# Altium schematic sheet FLASH_EMMC.SchDoc
size 420 x 297 mm; SheetNumber: 17; SheetTotal: 23
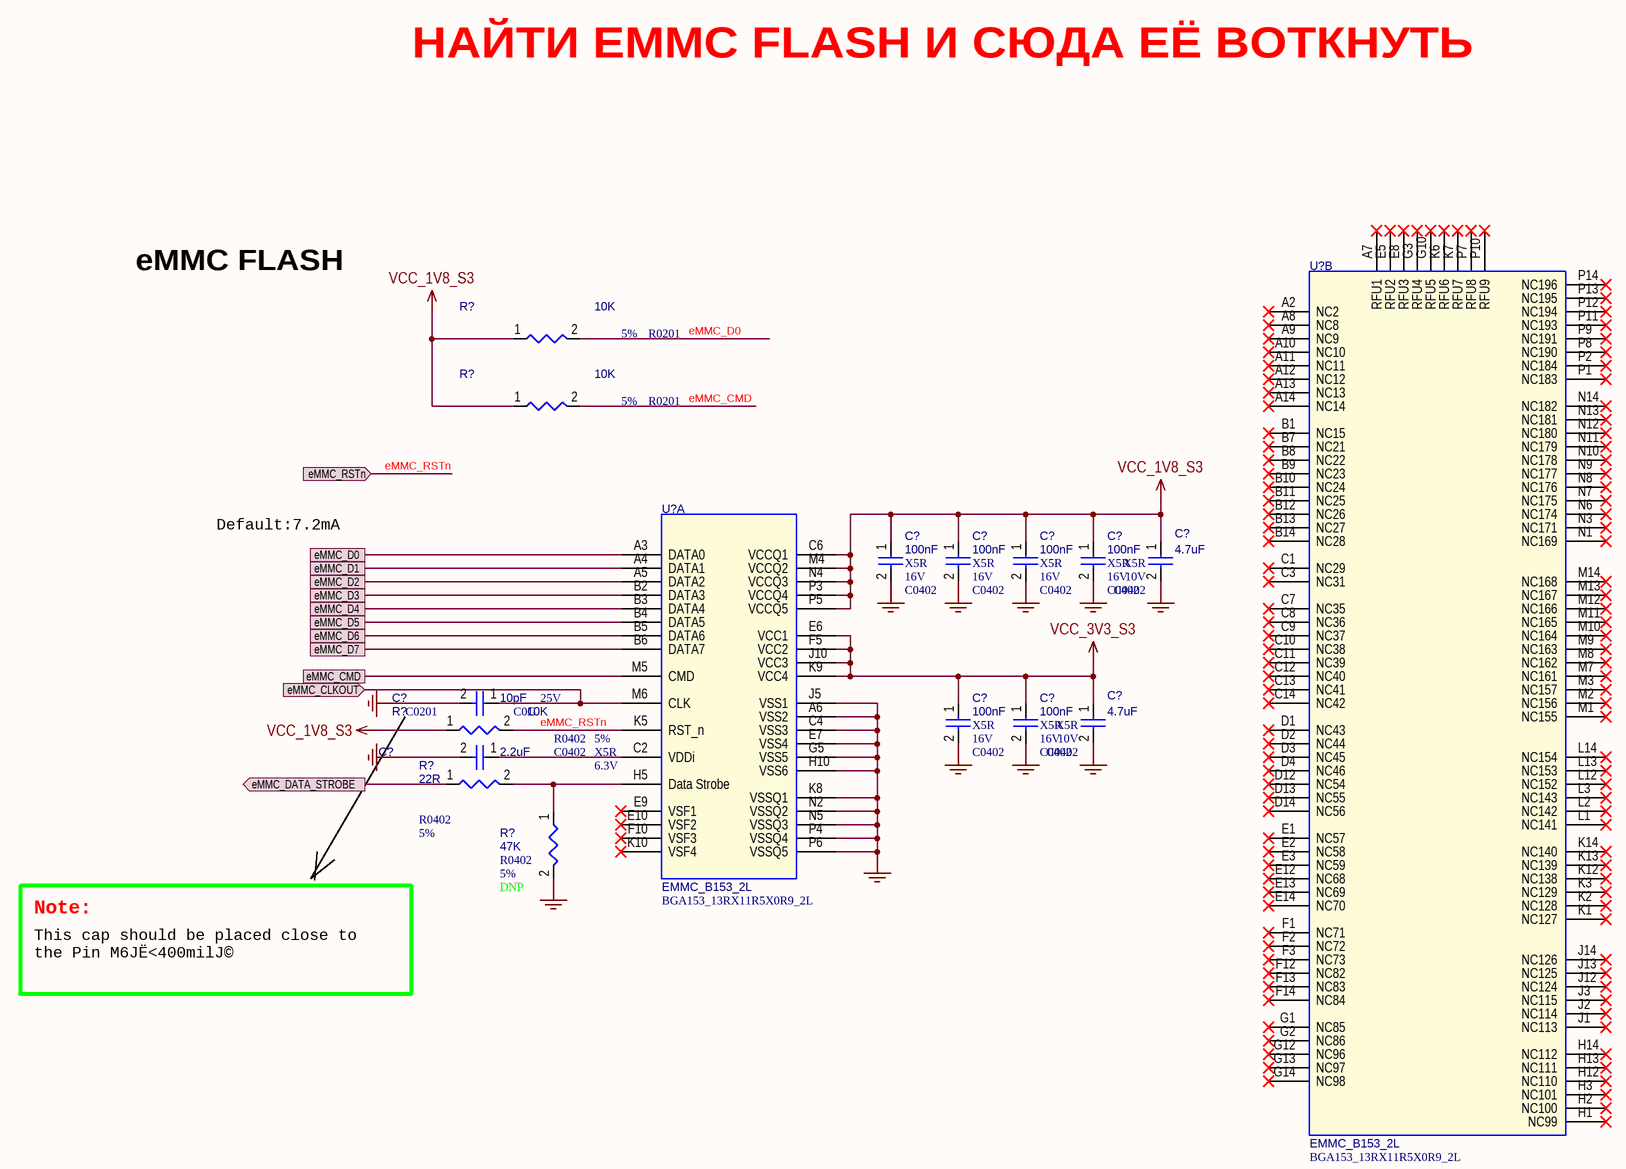
[diagram p0: FLASH_EMMC.SchDoc]

## Parts
(Parts that share a designator on the sheet are numbered #1, #2 ... from top to bottom, then left to right.)
C?#1  100nF  Dielectric: X5R  Voltage: 16V  [C0402]
C?#2  100nF  Dielectric: X5R  Voltage: 16V  [C0402]
C?#3  100nF  Dielectric: X5R  Voltage: 16V  [C0402]
C?#4  100nF  Dielectric: X5R  Voltage: 16V  [C0402]
C?#5  4.7uF  Dielectric: X5R  Voltage: 10V  [C0402]
C?#6  10pF  Dielectric: C0G  Voltage: 25V  [C0201]
C?#7  100nF  Dielectric: X5R  Voltage: 16V  [C0402]
C?#8  100nF  Dielectric: X5R  Voltage: 16V  [C0402]
C?#9  4.7uF  Dielectric: X5R  Voltage: 10V  [C0402]
C?#10  2.2uF  Dielectric: X5R  Voltage: 6.3V  [C0402]
R?#1  10K  Tolerance: 5%  PCB Footprint: R0201  [R0402]
R?#2  10K  Tolerance: 5%  PCB Footprint: R0201  [R0402]
R?#3  10K  Tolerance: 5%  [R0402]
R?#4  22R  Tolerance: 5%  [R0402]
R?#5  47K  Tolerance: 5%  option: DNP  [R0402]
U?#1  EMMC_B153_2L  [BGA153_13RX11R5X0R9_2L]  (part B of 2)
U?#2  EMMC_B153_2L  [BGA153_13RX11R5X0R9_2L]  (part A of 2)

## Ports
eMMC_CLKOUT (in, see RK3588_FLASH_SD_EMMC[3B]), eMMC_CMD (see RK3588_FLASH_SD_EMMC[3B]), eMMC_D0 (see RK3588_FLASH_SD_EMMC[3B]), eMMC_D1 (see RK3588_FLASH_SD_EMMC[3B]), eMMC_D2 (see RK3588_FLASH_SD_EMMC[3B]), eMMC_D3 (see RK3588_FLASH_SD_EMMC[3B]), eMMC_D4 (see RK3588_FLASH_SD_EMMC[3B]), eMMC_D5 (see RK3588_FLASH_SD_EMMC[3B]), eMMC_D6 (see RK3588_FLASH_SD_EMMC[3B]), eMMC_D7 (see RK3588_FLASH_SD_EMMC[3B]), eMMC_DATA_STROBE (out, see RK3588_FLASH_SD_EMMC[3B]), eMMC_RSTn (in, see RK3588_FLASH_SD_EMMC[3B])

## Nets
GND: C?#1.2 C?#2.2 C?#3.2 C?#4.2 C?#5.2 C?#6.2 C?#7.2 C?#8.2 C?#9.2 C?#10.2 R?#5.2 U?#2.A6(VSS2) U?#2.C4(VSS3) U?#2.E7(VSS4) U?#2.G5(VSS5) U?#2.H10(VSS6) U?#2.J5(VSS1) U?#2.K8(VSSQ1) U?#2.N2(VSSQ2) U?#2.N5(VSSQ3) U?#2.P4(VSSQ4) U?#2.P6(VSSQ5)
VCC_1V8_S3: C?#1.1 C?#2.1 C?#3.1 C?#4.1 C?#5.1 R?#1.1 R?#2.1 R?#3.1 U?#2.C6(VCCQ1) U?#2.M4(VCCQ2) U?#2.N4(VCCQ3) U?#2.P3(VCCQ4) U?#2.P5(VCCQ5)
VCC_3V3_S3: C?#7.1 C?#8.1 C?#9.1 U?#2.E6(VCC1) U?#2.F5(VCC2) U?#2.J10(VCC3) U?#2.K9(VCC4)
eMMC_CLKOUT: C?#6.1 U?#2.M6(CLK) ; port eMMC_CLKOUT
eMMC_CMD: R?#2.2
eMMC_CMD: U?#2.M5(CMD) ; port eMMC_CMD  [a separate net that carries the same name]
eMMC_D0: R?#1.2
eMMC_D0: U?#2.A3(DATA0) ; port eMMC_D0  [a separate net that carries the same name]
eMMC_D1: U?#2.A4(DATA1) ; port eMMC_D1
eMMC_D2: U?#2.A5(DATA2) ; port eMMC_D2
eMMC_D3: U?#2.B2(DATA3) ; port eMMC_D3
eMMC_D4: U?#2.B3(DATA4) ; port eMMC_D4
eMMC_D5: U?#2.B4(DATA5) ; port eMMC_D5
eMMC_D6: U?#2.B5(DATA6) ; port eMMC_D6
eMMC_D7: U?#2.B6(DATA7) ; port eMMC_D7
eMMC_DATA_STROBE: R?#4.1 ; port eMMC_DATA_STROBE
eMMC_RSTn: R?#3.2 U?#2.K5(RST_n) ; port eMMC_RSTn
NetC?#10_1: C?#10.1 U?#2.C2(VDDi)
NetR?#4_2: R?#4.2 R?#5.1 U?#2.H5(Data_Strobe)

Not connected (* = marked no-connect by the designer): U?#1 A2(NC2)* A7(RFU1)* A8(NC8)* A9(NC9)* A10(NC10)* A11(NC11)* A12(NC12)* A13(NC13)* A14(NC14)* B1(NC15)* B7(NC21)* B8(NC22)* B9(NC23)* B10(NC24)* B11(NC25)* B12(NC26)* B13(NC27)* B14(NC28)* C1(NC29)* C3(NC31)* C7(NC35)* C8(NC36)* C9(NC37)* C10(NC38)* C11(NC39)* C12(NC40)* C13(NC41)* C14(NC42)* D1(NC43)* D2(NC44)* D3(NC45)* D4(NC46)* D12(NC54)* D13(NC55)* D14(NC56)* E1(NC57)* E2(NC58)* E3(NC59)* E5(RFU2)* E8(RFU3)* E12(NC68)* E13(NC69)* E14(NC70)* F1(NC71)* F2(NC72)* F3(NC73)* F12(NC82)* F13(NC83)* F14(NC84)* G1(NC85)* G2(NC86)* G3(RFU4)* G10(RFU5)* G12(NC96)* G13(NC97)* G14(NC98)* H1(NC99)* H2(NC100)* H3(NC101)* H12(NC110)* H13(NC111)* H14(NC112)* J1(NC113)* J2(NC114)* J3(NC115)* J12(NC124)* J13(NC125)* J14(NC126)* K1(NC127)* K2(NC128)* K3(NC129)* K6(RFU6)* K7(RFU7)* K12(NC138)* K13(NC139)* K14(NC140)* L1(NC141)* L2(NC142)* L3(NC143)* L12(NC152)* L13(NC153)* L14(NC154)* M1(NC155)* M2(NC156)* M3(NC157)* M7(NC161)* M8(NC162)* M9(NC163)* M10(NC164)* M11(NC165)* M12(NC166)* M13(NC167)* M14(NC168)* N1(NC169)* N3(NC171)* N6(NC174)* N7(NC175)* N8(NC176)* N9(NC177)* N10(NC178)* N11(NC179)* N12(NC180)* N13(NC181)* N14(NC182)* P1(NC183)* P2(NC184)* P7(RFU8)* P8(NC190)* P9(NC191)* P10(RFU9)* P11(NC193)* P12(NC194)* P13(NC195)* P14(NC196)*; U?#2 E9(VSF1)* E10(VSF2)* F10(VSF3)* K10(VSF4)*

## Notes on the sheet
- НАЙТИ EMMC FLASH И СЮДА ЕЁ ВОТКНУТЬ
- eMMC FLASH
- Default:7.2mA
- Note:
- This cap should be placed close to
  the Pin M6ЈЁ<400milЈ©
- 297x420
- Формат А3

## Library data of the parts
C?#1 = CAP NP_Dup1: cap,100.00nF,+/-10%,16V,X5R,C0402; Part Reference: C4000; Manufacturer: TDK; RK PN: C1005X5R1C104K050BA; Priority: A; Tolerance: 10%; PCB Footprint: C0402; Value: 100nF; Part Type: C0402; Manufacturer PN: C1005X5R1C104K050BA; Created by: JJJ
C?#2 = CAP NP_Dup1: cap,100.00nF,+/-10%,16V,X5R,C0402; Part Reference: C4001; Manufacturer PN: C1005X5R1C104K050BA; Manufacturer: TDK; Tolerance: 10%; Priority: A; PCB Footprint: C0402; Value: 100nF; Created by: JJJ; Part Type: C0402; RK PN: C1005X5R1C104K050BA
C?#3 = CAP NP_Dup1: cap,100.00nF,+/-10%,16V,X5R,C0402; Part Reference: C4002; Manufacturer PN: C1005X5R1C104K050BA; Manufacturer: TDK; Tolerance: 10%; Priority: A; PCB Footprint: C0402; Value: 100nF; Created by: JJJ; Part Type: C0402; RK PN: C1005X5R1C104K050BA
C?#4 = CAP NP_Dup1: cap,100.00nF,+/-10%,16V,X5R,C0402; Part Reference: C4003; Manufacturer: TDK; RK PN: C1005X5R1C104K050BA; Priority: A; Tolerance: 10%; PCB Footprint: C0402; Value: 100nF; Part Type: C0402; Manufacturer PN: C1005X5R1C104K050BA; Created by: JJJ
C?#5 = CAP NP_Dup1: cap,4.70uF,+/-10%,10V,X5R,C0402; Part Reference: C4004; Manufacturer: TDK; Number: 37; RK PN: C1005X5R1A475K050BC; Priority: A; Tolerance: 10%; C_Voltage: 6.3V; PCB Footprint: C0402; Value: 4.7uF; Part Type: C0402; Manufacturer PN: C1005X5R1A475K050BC; Created by: JJJ
C?#6 = CAP NP_Dup1: cap,10.00pF,+/-0.5,25V,C0G,C0201; Part Reference: C4005; Manufacturer: TDK; RK PN: C0603C0G1E100D030BA; Priority: A; Tolerance: +/-0.5pF; PCB Footprint: C0201; Value: 10pF; Part Type: C0201; Manufacturer PN: C0603C0G1E100D030BA; Created by: JJJ
C?#7 = CAP NP_Dup1: cap,100.00nF,+/-10%,16V,X5R,C0402; Part Reference: C4006; Manufacturer PN: C1005X5R1C104K050BA; Manufacturer: TDK; Tolerance: 10%; Priority: A; PCB Footprint: C0402; Value: 100nF; Created by: JJJ; Part Type: C0402; RK PN: C1005X5R1C104K050BA
C?#8 = CAP NP_Dup1: cap,100.00nF,+/-10%,16V,X5R,C0402; Part Reference: C4007; Manufacturer PN: C1005X5R1C104K050BA; Manufacturer: TDK; Tolerance: 10%; Priority: A; PCB Footprint: C0402; Value: 100nF; Created by: JJJ; Part Type: C0402; RK PN: C1005X5R1C104K050BA
C?#9 = CAP NP_Dup1: cap,4.70uF,+/-10%,10V,X5R,C0402; Part Reference: C4008; Manufacturer: TDK; Number: 37; RK PN: C1005X5R1A475K050BC; Priority: A; Tolerance: 10%; C_Voltage: 6.3V; PCB Footprint: C0402; Value: 4.7uF; Part Type: C0402; Manufacturer PN: C1005X5R1A475K050BC; Created by: JJJ
C?#10 = CAP NP_Dup1: cap,2.20uF,+/-10%,6.3V,X5R,C0402; Part Reference: C4009; Manufacturer: TDK; RK PN: C1005X5R0J225K050BC; Priority: A; Tolerance: 10%; PCB Footprint: C0402; Value: 2.2uF; Part Type: C0402; Manufacturer PN: C1005X5R0J225K050BC; Created by: JJJ
R?#1 = RESISTOR_Dup2: НЁУГєсД¤µзЧи,10K,+/-5%,R0201,1/20W.; Part Reference: R4001; Manufacturer: YAGEO; RK PN: RC0201JR-0710KL; Priority: A; Wattage: 1/20W; Value: 10K; Part Type: НЁУГєсД¤µзЧи; Manufacturer PN: RC0201JR-0710KL; Created by: YTL
R?#2 = RESISTOR_Dup2: НЁУГєсД¤µзЧи,10K,+/-5%,R0201,1/20W.; Part Reference: R4000; Manufacturer: YAGEO; RK PN: RC0201JR-0710KL; Priority: A; Wattage: 1/20W; Value: 10K; Part Type: НЁУГєсД¤µзЧи; Manufacturer PN: RC0201JR-0710KL; Created by: YTL
R?#3 = RESISTOR_Dup2: НЁУГєсД¤µзЧи,10K,+/-5%,R0402,1/16W.; Part Reference: R4002; Manufacturer PN: RC0402JR-0710KL; Manufacturer: YAGEO; Wattage: 1/16W; Priority: A; PCB Footprint: R0402; Value: 10K; Created by: YTL; Part Type: НЁУГєсД¤µзЧи; RK PN: RC0402JR-0710KL
R?#4 = RESISTOR_Dup2: НЁУГєсД¤µзЧи,22R,+/-5%,R0402,1/16W.; Part Reference: R4003; Manufacturer PN: RC0402JR-0722RL; Manufacturer: YAGEO; Wattage: 1/16W; Priority: A; PCB Footprint: R0402; Value: 22R; Created by: YTL; Part Type: НЁУГєсД¤µзЧи; RK PN: RC0402JR-0722RL
R?#5 = RESISTOR_Dup2: НЁУГєсД¤µзЧи,47K,+/-5%,R0402,1/16W.; Part Reference: R4004; Manufacturer: YAGEO; RK PN: RC0402JR-0747KL; Priority: A; Wattage: 1/16W; PCB Footprint: R0402; Value: 47K; Part Type: НЁУГєсД¤µзЧи; Manufacturer PN: RC0402JR-0747KL; Created by: YTL
U?#1 U?#2 = INAND_EMMC_153_2L: EMMC_B153_2L,ёьєГµДВъЧг№¤ТХРиЗуЈ¬Fanout·ЅКЅІї·ЦЧЯПЯїзЅУФЩЗтО»ЙПЈ¬НЪіэA1\C5ЗтО»; Part Reference: U4000; Priority: A; PCB Footprint: BGA153_13RX11R5X0R9_2L; Value: EMMC_B153_2L; Created by: YWQ; Part Type: NAND_FLASH; RK PN: EMMC_B153_2L